# EAGLE design MouseGoggles HatBrd-1-0 (EAGLE 9.6.2)
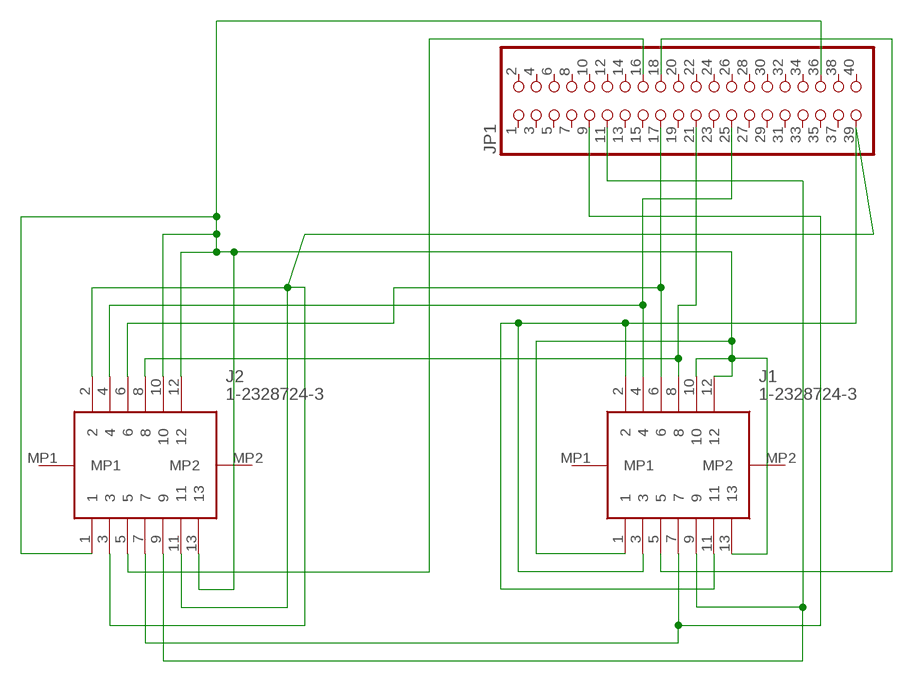
[diagram p0: schematic, sheet 1]

## Parts
J1  1-2328724-3  [123287243]
J2  1-2328724-3  [123287243]
JP1  PINHD-2X20-BIG  [2X20-BIG]

## Nets
N$1: J1.2 J1.3 J1.11 J2.2 J2.3 J2.11 JP1.39
N$4: J1.8 J2.8 JP1.21
N$5: J1.6 J2.6 JP1.17
N$6: J1.5 JP1.18
N$7: J1.1 J1.10 J1.12 J1.13 J2.1 J2.10 J2.12 J2.13 JP1.36
N$8: J1.4 J2.4 JP1.25
N$9: J1.7 J2.7 JP1.9
N$15: J1.9 J2.9 JP1.11
N$16: J2.5 JP1.16
Unconnected: J1.MP1 J1.MP2 J2.MP1 J2.MP2 JP1.1 JP1.2 JP1.3 JP1.4 JP1.5 JP1.6 JP1.7 JP1.8 JP1.10 JP1.12 JP1.13 JP1.14 JP1.15 JP1.19 JP1.20 JP1.22 JP1.23 JP1.24 JP1.26 JP1.27 JP1.28 JP1.29 JP1.30 JP1.31 JP1.32 JP1.33 JP1.34 JP1.35 JP1.37 JP1.38 JP1.40

## Library data of the parts
J1 J2 = 1-2328724-3:1-2328724-3: AMP - TE CONNECTIVITY - 1-2328724-3 - CONNECTOR, FPC, R/A, 13POS, 1ROW, 0.3MM Source: Datasheet <https://www.te.com/commerce/DocumentDelivery/DDEController?Action=showdoc&DocId=Customer Drawing23287243pdfEnglishENG_CD_2328724_3.pdf1-2328724-3>; DESCRIPTION: AMP - TE CONNECTIVITY - 1-2328724-3 - CONNECTOR, FPC, R/A, 13POS, 1ROW, 0.3MM; HEIGHT: 1.1mm; MANUFACTURER_NAME: TE Connectivity; MANUFACTURER_PART_NUMBER: 1-2328724-3; MOUSER_PART_NUMBER: 571-1-2328724-3; MOUSER_PRICE-STOCK: https://www.mouser.co.uk/ProductDetail/TE-Connectivity/1-2328724-3?qs=w%2Fv1CP2dgqo8aBCjMy0R7g%3D%3D
JP1 = adafruit:PINHD-2X20: PIN HEADER

## Board
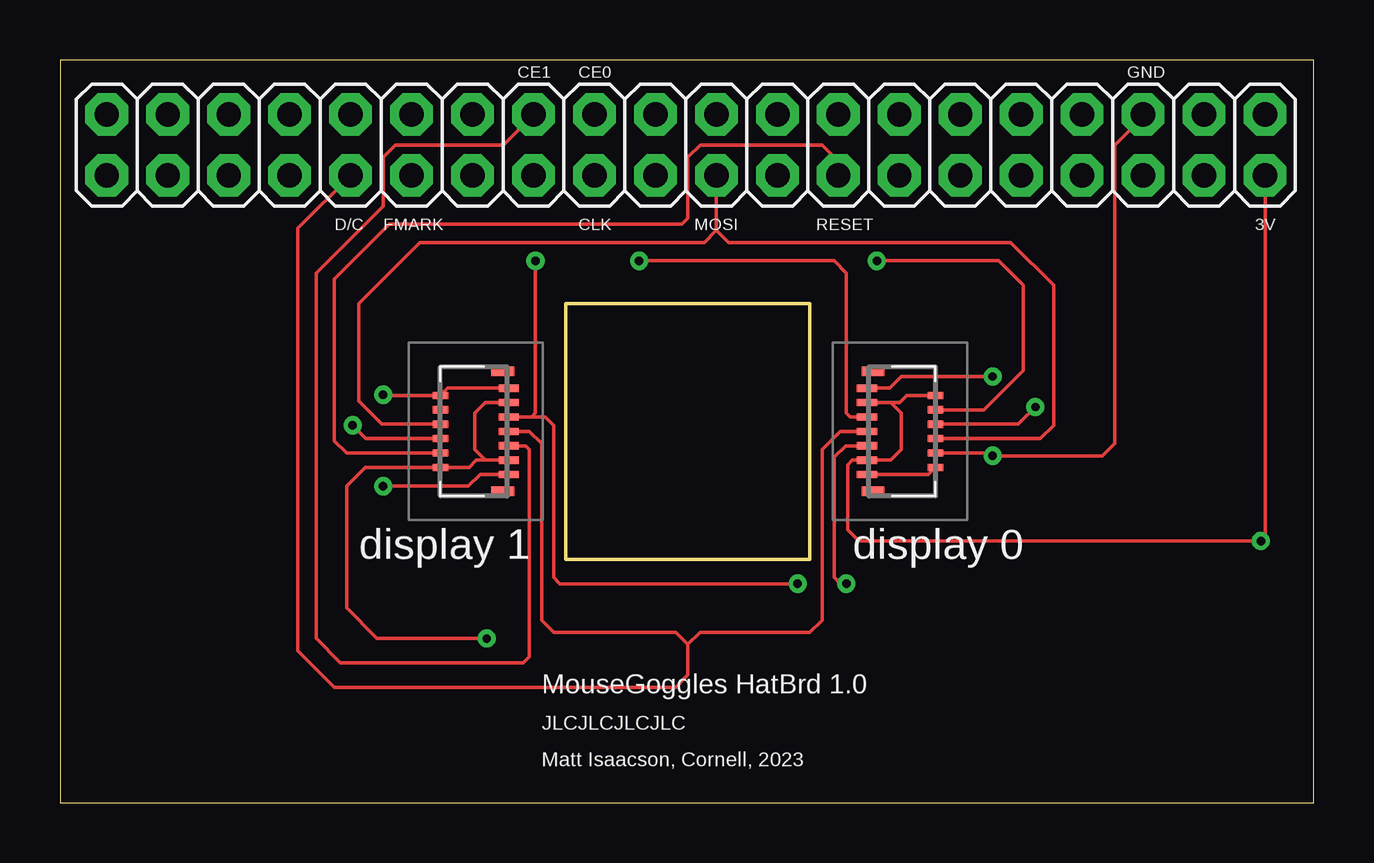
[diagram p1: board, top side]
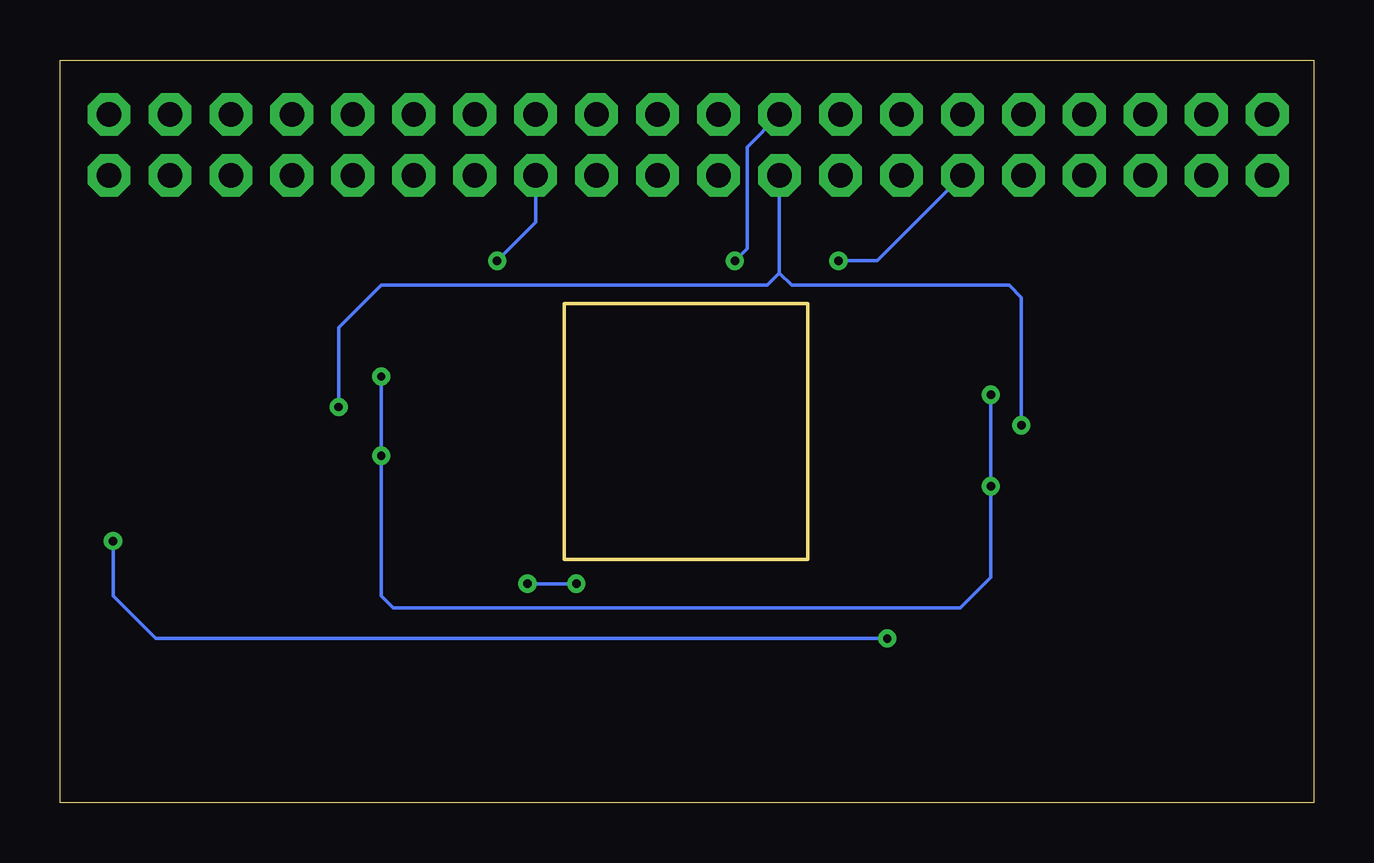
[diagram p2: board, bottom side, seen from below]

Size 52.25 x 30.98 mm. Coordinates in mm from the lower left corner, seen from the top.
Outline: 0,0 52.25,0 52.25,30.98 0,30.98 0,0
Copper layers (1*16): Top 0.035mm / dielectric 1.5mm / Bottom 0.035mm
Design rules "default": minimum track width 6mil, minimum drill 0.35mm, track to track 6mil, track to pad 6mil, pad to pad 6mil, via to via 6mil, smd to smd 6mil, copper to edge 40mil, drill to drill 6mil, minimum pad ring 10mil, minimum via ring 8mil, stop-mask expansion 4mil, vias tented up to drill 0mil, thermal gap 10mil
Milling: area 21.1,10.2 to 31.2,20.8

### Footprints (pad centres in the part's own frame; a part is rotated, then mirrored left to right if it is on the bottom)
123287243 = smd 0.3 x 0.85: 1 -1.8,-1.425; 3 -1.2,-1.425; 5 -0.6,-1.425; 7 0,-1.425; 9 0.6,-1.425; 11 1.2,-1.425; 13 1.8,-1.425 | smd 0.3 x 0.65: 2 -1.5,1.425; 4 -0.9,1.425; 6 -0.3,1.425; 8 0.3,1.425; 10 0.9,1.425; 12 1.5,1.425 | smd 0.4 x 0.95: MP1 -2.5,-1.175; MP2 2.5,-1.175
2X20-BIG = drill 1.016 pad 1.778 octagon: 1 -24.13,-1.27; 2 -24.13,1.27; 3 -21.59,-1.27; 4 -21.59,1.27; 5 -19.05,-1.27; 6 -19.05,1.27; 7 -16.51,-1.27; 8 -16.51,1.27; 9 -13.97,-1.27; 10 -13.97,1.27; 11 -11.43,-1.27; 12 -11.43,1.27; 13 -8.89,-1.27; 14 -8.89,1.27; 15 -6.35,-1.27; 16 -6.35,1.27; 17 -3.81,-1.27; 18 -3.81,1.27; 19 -1.27,-1.27; 20 -1.27,1.27; 21 1.27,-1.27; 22 1.27,1.27; 23 3.81,-1.27; 24 3.81,1.27; 25 6.35,-1.27; 26 6.35,1.27; 27 8.89,-1.27; 28 8.89,1.27; 29 11.43,-1.27; 30 11.43,1.27; 31 13.97,-1.27; 32 13.97,1.27; 33 16.51,-1.27; 34 16.51,1.27; 35 19.05,-1.27; 36 19.05,1.27; 37 21.59,-1.27; 38 21.59,1.27; 39 24.13,-1.27; 40 24.13,1.27

### Placement (x,y rotation side)
J1  35.05,15.49 270 top
J2  17.27,15.49 90 top
JP1  26.08,27.43 0 top

### Tracks (layer width: path | path; a pad name or v marks a point on that pad's centre or on a via)
N$1  (via drill 0.35)
  Top 0.152: J1.2 35.28,16.99 34.98,16.69 J1.3 34.61,16.69 35.05,16.26 35.05,14.73 34.61,14.29 J1.11 33.02,14.29 32.82,14.09 32.82,11.38 33.27,10.92 v50.04,10.92 50.21,11.09 JP1.39 | J2.11 17.71,16.69 17.27,16.26 17.27,14.73 17.71,14.29 J2.3 17.34,14.29 17.04,13.99 J2.2 12.72,13.99 11.94,13.21 11.94,8.13 13.21,6.86 v17.78,6.86
  Bottom 0.152: v50.04,10.92 50.04,8.64 48.26,6.86 v17.78,6.86
N$4
  Top 0.152: JP1.21 27.35,23.88 | J2.8 13.42,15.79 12.45,16.76 12.45,20.83 14.99,23.37 26.84,23.37 27.35,23.88 | J1.8 40.85,15.19 41.4,15.75 41.4,21.59 39.62,23.37 27.86,23.37 27.35,23.88
N$5  (via drill 0.35)
  Top 0.152: J2.6 12.75,15.19 v12.19,15.75 | v40.64,16.51 39.92,15.79 J1.6
  Bottom 0.152: v12.19,15.75 12.19,21.08 12.7,21.59 21.34,21.59 21.76,21.59 22.27,22.1 | JP1.17 22.27,22.1 | v40.64,16.51 40.64,19.81 38.86,21.59 22.78,21.59 22.27,22.1
N$6  (via drill 0.35)
  Top 0.152: J1.5 32.93,16.09 32.77,16.26 32.77,22.1 32.26,22.61 v24.13,22.61
  Bottom 0.152: JP1.18 23.62,27.35 23.62,23.11 v24.13,22.61
N$7  (via drill 0.35)
  Top 0.152: J1.13 36.18,13.69 J1.12 J1.10 38.75,14.59 v38.86,14.48 43.43,14.48 43.94,14.99 43.94,27.43 45.13,28.62 JP1.36 | J2.10 J2.12 | J2.12 16.15,17.29 J2.13 | J2.1 17.5,13.69 17.02,13.21 v13.46,13.21 | J2.12 13.49,16.99 v13.46,17.02 | J1.1 34.57,17.29 35.05,17.78 v38.86,17.78
  Bottom 0.152: v13.46,17.02 v13.46,13.21 13.46,9.4 14.73,8.13 38.35,8.13 38.86,8.64 v38.86,14.48 v38.86,17.78
N$8  (via drill 0.35)
  Top 0.152: J2.4 12.05,14.59 11.94,14.59 11.43,15.1 11.43,21.84 13.72,24.13 25.91,24.13 26.16,24.38 26.16,26.92 26.67,27.43 31.75,27.43 32.43,26.75 JP1.25 | J1.4 38.49,16.39 40.13,18.03 40.13,21.59 39.12,22.61 v34.04,22.61
  Bottom 0.152: v34.04,22.61 32.43,24.21 JP1.25
N$9
  Top 0.152: JP1.9 9.91,23.96 9.91,6.35 11.43,4.83 25.65,4.83 26.16,5.33 26.16,6.6 | J2.7 19.56,15.49 20.07,14.99 20.07,7.62 20.57,7.11 25.65,7.11 26.16,6.6 | J1.7 32.51,15.49 31.75,14.73 31.75,7.62 31.24,7.11 26.67,7.11 26.16,6.6
N$15  (via drill 0.35)
  Top 0.152: v19.81,22.61 19.81,16.26 19.65,16.09 | 19.65,16.09 J2.9 | v32.77,9.14 32.51,9.14 32.26,9.4 32.26,14.42 32.73,14.89 J1.9 | v30.73,9.14 20.83,9.14 20.57,9.4 20.57,15.75 20.23,16.09 19.65,16.09
  Bottom 0.152: JP1.11 18.2,22.61 v19.81,22.61 | v32.77,9.14 v30.73,9.14
N$16
  Top 0.152: JP1.16 18.46,27.43 13.97,27.43 13.46,26.92 13.46,24.89 10.67,22.1 10.67,6.86 11.68,5.84 19.3,5.84 19.56,6.1 19.56,14.73 19.4,14.89 J2.5

### Text on the board
tNames: CE1 | CE0 | GND | D/C | FMARK | CLK | MOSI | RESET | 3V | display 1 | display 0 | MouseGoggles HatBrd 1.0 | JLCJLCJLCJLC | Matt Isaacson, Cornell, 2023